# EAGLE design teensyShield1.6 (EAGLE 7.7.0)
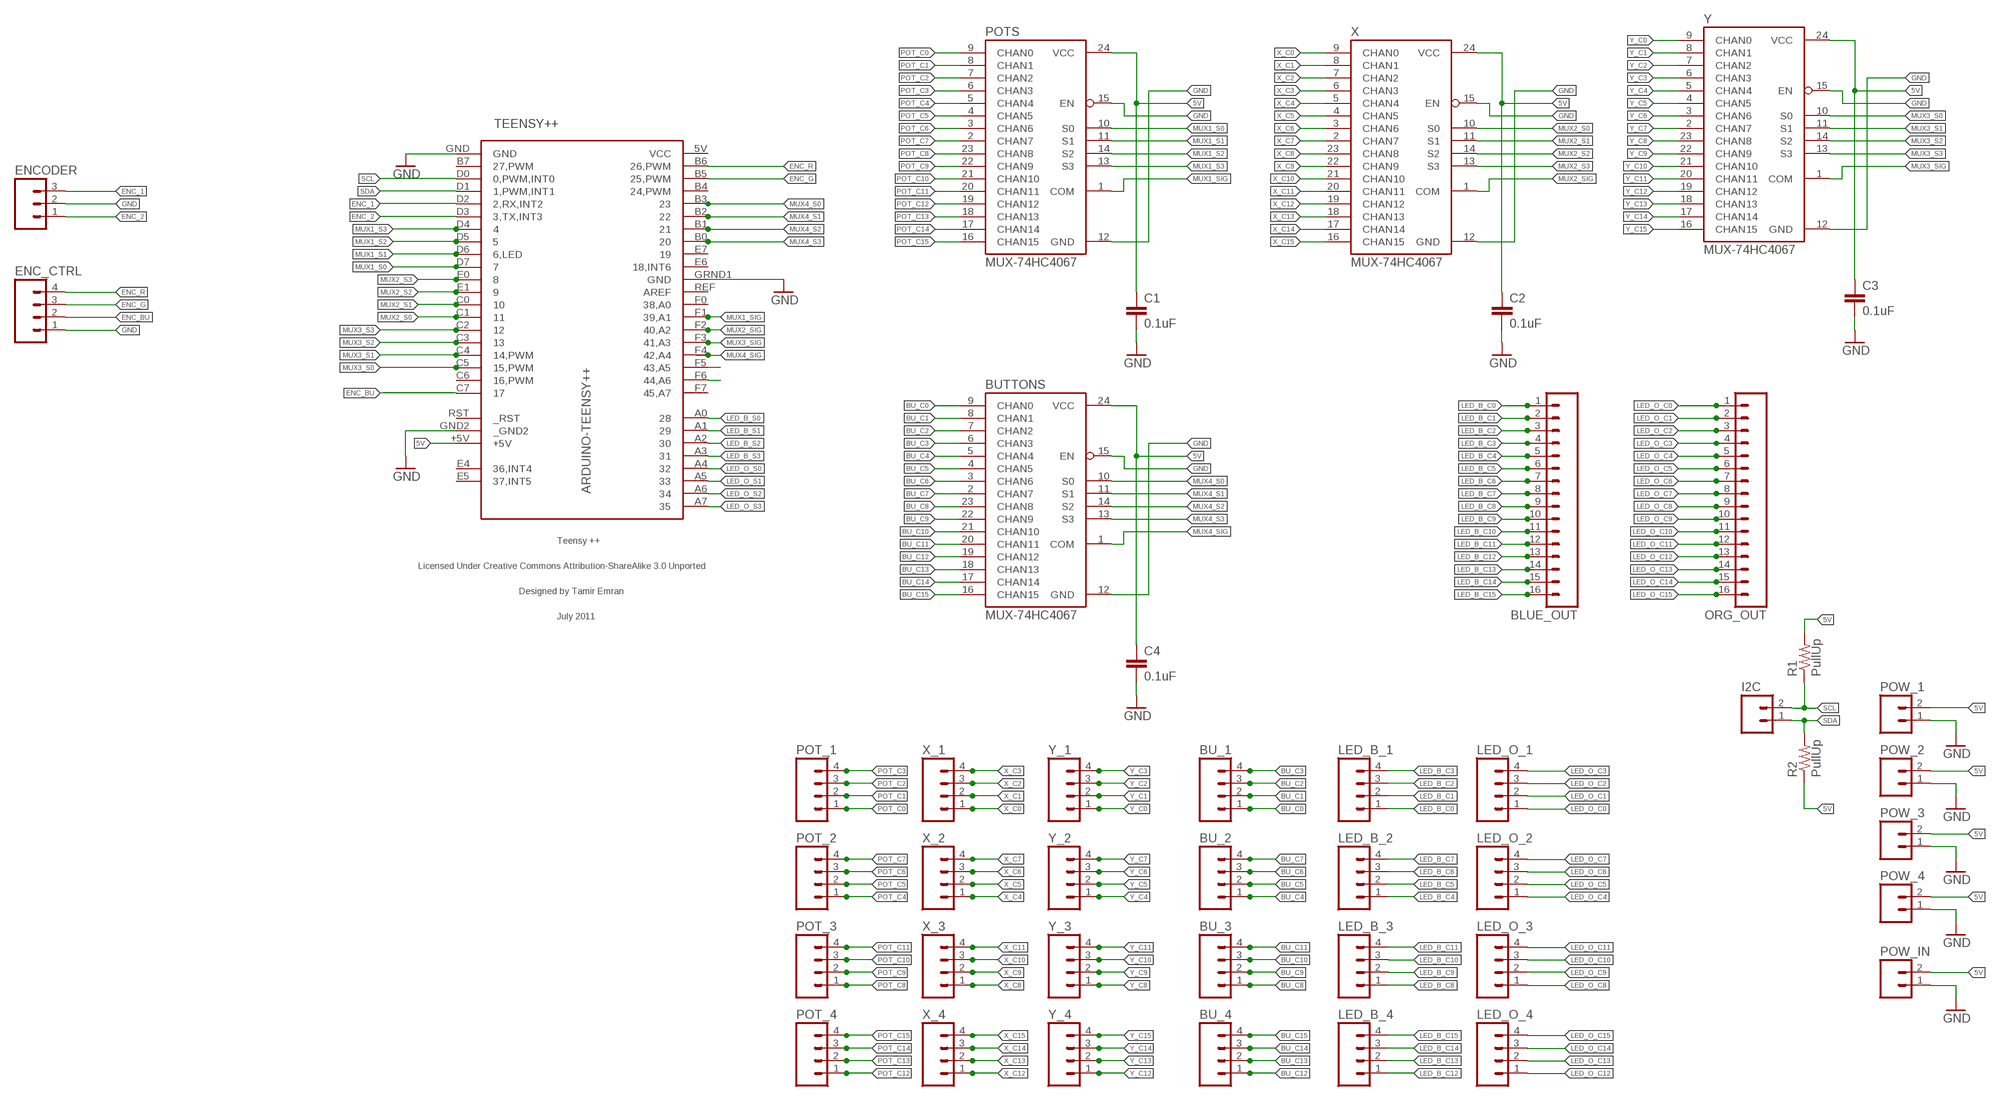
[diagram p0: schematic, sheet 1]

## Parts
BLUE_OUT  M161X16_NO_SILK  [1X16_NO_SILK]
BU_1  M04NO_SILK_ALL_ROUND  [1X04_NO_SILK_ALL_ROUND]
BU_2  M04NO_SILK_ALL_ROUND  [1X04_NO_SILK_ALL_ROUND]
BU_3  M04NO_SILK_ALL_ROUND  [1X04_NO_SILK_ALL_ROUND]
BU_4  M04NO_SILK_ALL_ROUND  [1X04_NO_SILK_ALL_ROUND]
BUTTONS  MUX-74HC4067  MUX-74HC4067SMD  [SSOP24]
C1  0.1uF  CAP0603  [0603]
C2  0.1uF  CAP0603  [0603]
C3  0.1uF  CAP0603  [0603]
C4  0.1uF  CAP0603  [0603]
ENC_CTRL  M041X04_NO_SILK  [1X04_NO_SILK]
ENCODER  M031X03_NO_SILK  [1X03_NO_SILK]
I2C  M02LOCK  [1X02_LOCK]
LED_B_1  M04NO_SILK_ALL_ROUND  [1X04_NO_SILK_ALL_ROUND]
LED_B_2  M04NO_SILK_ALL_ROUND  [1X04_NO_SILK_ALL_ROUND]
LED_B_3  M04NO_SILK_ALL_ROUND  [1X04_NO_SILK_ALL_ROUND]
LED_B_4  M04NO_SILK_ALL_ROUND  [1X04_NO_SILK_ALL_ROUND]
LED_O_1  M04NO_SILK_ALL_ROUND  [1X04_NO_SILK_ALL_ROUND]
LED_O_2  M04NO_SILK_ALL_ROUND  [1X04_NO_SILK_ALL_ROUND]
LED_O_3  M04NO_SILK_ALL_ROUND  [1X04_NO_SILK_ALL_ROUND]
LED_O_4  M04NO_SILK_ALL_ROUND  [1X04_NO_SILK_ALL_ROUND]
ORG_OUT  M161X16_NO_SILK  [1X16_NO_SILK]
POT_1  M04NO_SILK_ALL_ROUND  [1X04_NO_SILK_ALL_ROUND]
POT_2  M04NO_SILK_ALL_ROUND  [1X04_NO_SILK_ALL_ROUND]
POT_3  M04NO_SILK_ALL_ROUND  [1X04_NO_SILK_ALL_ROUND]
POT_4  M04NO_SILK_ALL_ROUND  [1X04_NO_SILK_ALL_ROUND]
POTS  MUX-74HC4067  MUX-74HC4067SMD  [SSOP24]
POW_1  M02POLAR  [MOLEX-1X2]
POW_2  M02POLAR  [MOLEX-1X2]
POW_3  M02POLAR  [MOLEX-1X2]
POW_4  M02POLAR  [MOLEX-1X2]
POW_IN  M02POLAR  [MOLEX-1X2]
R1  PullUp  10KOHM-1/4W5%(PTH)  [AXIAL-0.3]
R2  PullUp  10KOHM-1/4W5%(PTH)  [AXIAL-0.3]
TEENSY++  ARDUINO-TEENSY++  [TEENSY++]
X  MUX-74HC4067  MUX-74HC4067SMD  [SSOP24]
X_1  M04NO_SILK_ALL_ROUND  [1X04_NO_SILK_ALL_ROUND]
X_2  M04NO_SILK_ALL_ROUND  [1X04_NO_SILK_ALL_ROUND]
X_3  M04NO_SILK_ALL_ROUND  [1X04_NO_SILK_ALL_ROUND]
X_4  M04NO_SILK_ALL_ROUND  [1X04_NO_SILK_ALL_ROUND]
Y  MUX-74HC4067  MUX-74HC4067SMD  [SSOP24]
Y_1  M04NO_SILK_ALL_ROUND  [1X04_NO_SILK_ALL_ROUND]
Y_2  M04NO_SILK_ALL_ROUND  [1X04_NO_SILK_ALL_ROUND]
Y_3  M04NO_SILK_ALL_ROUND  [1X04_NO_SILK_ALL_ROUND]
Y_4  M04NO_SILK_ALL_ROUND  [1X04_NO_SILK_ALL_ROUND]

## Nets
5V: BUTTONS.24(VCC) C1.1 C2.1 C3.1 C4.1 POTS.24(VCC) POW_1.2 POW_2.2 POW_3.2 POW_4.2 POW_IN.2 R1.P$2 R2.P$1 TEENSY++.+5V X.24(VCC) Y.24(VCC)
BU_C0: BU_1.1 BUTTONS.9(CHAN0)
BU_C1: BU_1.2 BUTTONS.8(CHAN1)
BU_C2: BU_1.3 BUTTONS.7(CHAN2)
BU_C3: BU_1.4 BUTTONS.6(CHAN3)
BU_C4: BU_2.1 BUTTONS.5(CHAN4)
BU_C5: BU_2.2 BUTTONS.4(CHAN5)
BU_C6: BU_2.3 BUTTONS.3(CHAN6)
BU_C7: BU_2.4 BUTTONS.2(CHAN7)
BU_C8: BU_3.1 BUTTONS.23(CHAN8)
BU_C9: BU_3.2 BUTTONS.22(CHAN9)
BU_C10: BU_3.3 BUTTONS.21(CHAN10)
BU_C11: BU_3.4 BUTTONS.20(CHAN11)
BU_C12: BU_4.1 BUTTONS.19(CHAN12)
BU_C13: BU_4.2 BUTTONS.18(CHAN13)
BU_C14: BU_4.3 BUTTONS.17(CHAN14)
BU_C15: BU_4.4 BUTTONS.16(CHAN15)
ENC_1: ENCODER.3 TEENSY++.D2(2,RX,INT2)
ENC_2: ENCODER.1 TEENSY++.D3(3,TX,INT3)
ENC_BU: ENC_CTRL.2 TEENSY++.C7
ENC_G: ENC_CTRL.3 TEENSY++.B5(25,PWM)
ENC_R: ENC_CTRL.4 TEENSY++.B6(26,PWM)
GND: BUTTONS.12(GND) BUTTONS.15(EN) C1.2 C2.2 C3.2 C4.2 ENC_CTRL.1 ENCODER.2 POTS.12(GND) POTS.15(EN) POW_1.1 POW_2.1 POW_3.1 POW_4.1 POW_IN.1 TEENSY++.GND TEENSY++.GND2(_GND2) TEENSY++.GRND1(GND) X.12(GND) X.15(EN) Y.12(GND) Y.15(EN)
LED_B_C0: BLUE_OUT.1 LED_B_1.1
LED_B_C1: BLUE_OUT.2 LED_B_1.2
LED_B_C2: BLUE_OUT.3 LED_B_1.3
LED_B_C3: BLUE_OUT.4 LED_B_1.4
LED_B_C4: BLUE_OUT.5 LED_B_2.1
LED_B_C5: BLUE_OUT.6 LED_B_2.2
LED_B_C6: BLUE_OUT.7 LED_B_2.3
LED_B_C7: BLUE_OUT.8 LED_B_2.4
LED_B_C8: BLUE_OUT.9 LED_B_3.1
LED_B_C9: BLUE_OUT.10 LED_B_3.2
LED_B_C10: BLUE_OUT.11 LED_B_3.3
LED_B_C11: BLUE_OUT.12 LED_B_3.4
LED_B_C12: BLUE_OUT.13 LED_B_4.1
LED_B_C13: BLUE_OUT.14 LED_B_4.2
LED_B_C14: BLUE_OUT.15 LED_B_4.3
LED_B_C15: BLUE_OUT.16 LED_B_4.4
LED_B_S0: TEENSY++.A0
LED_B_S1: TEENSY++.A1
LED_B_S2: TEENSY++.A2
LED_B_S3: TEENSY++.A3
LED_O_C0: LED_O_1.1 ORG_OUT.1
LED_O_C1: LED_O_1.2 ORG_OUT.2
LED_O_C2: LED_O_1.3 ORG_OUT.3
LED_O_C3: LED_O_1.4 ORG_OUT.4
LED_O_C4: LED_O_2.1 ORG_OUT.5
LED_O_C5: LED_O_2.2 ORG_OUT.6
LED_O_C6: LED_O_2.3 ORG_OUT.7
LED_O_C7: LED_O_2.4 ORG_OUT.8
LED_O_C8: LED_O_3.1 ORG_OUT.9
LED_O_C9: LED_O_3.2 ORG_OUT.10
LED_O_C10: LED_O_3.3 ORG_OUT.11
LED_O_C11: LED_O_3.4 ORG_OUT.12
LED_O_C12: LED_O_4.1 ORG_OUT.13
LED_O_C13: LED_O_4.2 ORG_OUT.14
LED_O_C14: LED_O_4.3 ORG_OUT.15
LED_O_C15: LED_O_4.4 ORG_OUT.16
LED_O_S0: TEENSY++.A4
LED_O_S1: TEENSY++.A5
LED_O_S2: TEENSY++.A6
LED_O_S3: TEENSY++.A7
MUX1_S0: POTS.10(S0) TEENSY++.D7
MUX1_S1: POTS.11(S1) TEENSY++.D6(6,LED)
MUX1_S2: POTS.14(S2) TEENSY++.D5
MUX1_S3: POTS.13(S3) TEENSY++.D4
MUX1_SIG: POTS.1(COM)
MUX2_S0: TEENSY++.C1 X.10(S0)
MUX2_S1: TEENSY++.C0 X.11(S1)
MUX2_S2: TEENSY++.E1 X.14(S2)
MUX2_S3: TEENSY++.E0 X.13(S3)
MUX2_SIG: X.1(COM)
MUX3_S0: TEENSY++.C5(15,PWM) Y.10(S0)
MUX3_S1: TEENSY++.C4(14,PWM) Y.11(S1)
MUX3_S2: TEENSY++.C3 Y.14(S2)
MUX3_S3: TEENSY++.C2 Y.13(S3)
MUX3_SIG: TEENSY++.F3(41,A3) Y.1(COM)
MUX4_S0: BUTTONS.10(S0) TEENSY++.B3
MUX4_S1: BUTTONS.11(S1) TEENSY++.B2
MUX4_S2: BUTTONS.14(S2) TEENSY++.B1
MUX4_S3: BUTTONS.13(S3) TEENSY++.B0
MUX4_SIG: BUTTONS.1(COM) TEENSY++.F4(42,A4)
N$1: TEENSY++.F2(40,A2)
N$2: TEENSY++.F1(39,A1)
N$3: TEENSY++.F5(43,A5)
N$5: TEENSY++.F6(44,A6)
POT_C0: POT_1.1 POTS.9(CHAN0)
POT_C1: POT_1.2 POTS.8(CHAN1)
POT_C2: POT_1.3 POTS.7(CHAN2)
POT_C3: POT_1.4 POTS.6(CHAN3)
POT_C4: POT_2.1 POTS.5(CHAN4)
POT_C5: POT_2.2 POTS.4(CHAN5)
POT_C6: POT_2.3 POTS.3(CHAN6)
POT_C7: POT_2.4 POTS.2(CHAN7)
POT_C8: POT_3.1 POTS.23(CHAN8)
POT_C9: POT_3.2 POTS.22(CHAN9)
POT_C10: POT_3.3 POTS.21(CHAN10)
POT_C11: POT_3.4 POTS.20(CHAN11)
POT_C12: POT_4.1 POTS.19(CHAN12)
POT_C13: POT_4.2 POTS.18(CHAN13)
POT_C14: POT_4.3 POTS.17(CHAN14)
POT_C15: POT_4.4 POTS.16(CHAN15)
SCL: I2C.2 R1.P$1 TEENSY++.D0(0,PWM,INT0)
SDA: I2C.1 R2.P$2 TEENSY++.D1(1,PWM,INT1)
X_C0: X.9(CHAN0) X_1.1
X_C1: X.8(CHAN1) X_1.2
X_C2: X.7(CHAN2) X_1.3
X_C3: X.6(CHAN3) X_1.4
X_C4: X.5(CHAN4) X_2.1
X_C5: X.4(CHAN5) X_2.2
X_C6: X.3(CHAN6) X_2.3
X_C7: X.2(CHAN7) X_2.4
X_C8: X.23(CHAN8) X_3.1
X_C9: X.22(CHAN9) X_3.2
X_C10: X.21(CHAN10) X_3.3
X_C11: X.20(CHAN11) X_3.4
X_C12: X.19(CHAN12) X_4.1
X_C13: X.18(CHAN13) X_4.2
X_C14: X.17(CHAN14) X_4.3
X_C15: X.16(CHAN15) X_4.4
Y_C0: Y.9(CHAN0) Y_1.1
Y_C1: Y.8(CHAN1) Y_1.2
Y_C2: Y.7(CHAN2) Y_1.3
Y_C3: Y.6(CHAN3) Y_1.4
Y_C4: Y.5(CHAN4) Y_2.1
Y_C5: Y.4(CHAN5) Y_2.2
Y_C6: Y.3(CHAN6) Y_2.3
Y_C7: Y.2(CHAN7) Y_2.4
Y_C8: Y.23(CHAN8) Y_3.1
Y_C9: Y.22(CHAN9) Y_3.2
Y_C10: Y.21(CHAN10) Y_3.3
Y_C11: Y.20(CHAN11) Y_3.4
Y_C12: Y.19(CHAN12) Y_4.1
Y_C13: Y.18(CHAN13) Y_4.2
Y_C14: Y.17(CHAN14) Y_4.3
Y_C15: Y.16(CHAN15) Y_4.4
Unconnected: TEENSY++.B4(24,PWM) TEENSY++.B7(27,PWM) TEENSY++.C6(16,PWM) TEENSY++.E4(36,INT4) TEENSY++.E5(37,INT5) TEENSY++.E6(18,INT6) TEENSY++.E7 TEENSY++.F0(38,A0) TEENSY++.F7(45,A7) TEENSY++.REF(AREF) TEENSY++.RST(_RST)

## Power pins joined to a net without a drawn wire
VCC: TEENSY++.5V(VCC)

## Library data of the parts
BLUE_OUT ORG_OUT = SparkFun-Connectors:M16: 1x16 .1" header
BU_1-BU_4 ENC_CTRL LED_B_1-LED_B_4 LED_O_1-LED_O_4 POT_1-POT_4 X_1-X_4 Y_1-Y_4 = SparkFun-Connectors:M04: Header 4 Standard 4-pin 0.1" header. Use with straight break away headers (SKU : PRT-00116), right angle break away headers (PRT-00553), swiss pins (PRT-00743), machine pins (PRT-00117), and female headers (PRT-00115). Molex polarized connector foot print use with SKU : PRT-08231 with associated crimp pins and housings. 1MM SMD Version SKU: PRT-10208; PROD_ID: CONN-09696
BUTTONS POTS X Y = SparkFun:MUX-74HC4067
C1-C4 = SparkFun:CAP: Capacitor Standard 0603 ceramic capacitor, and 0.1" leaded capacitor.
ENCODER = SparkFun-Connectors:M03: Header 3 Standard 3-pin 0.1" header. Use with straight break away headers (SKU : PRT-00116), right angle break away headers (PRT-00553), swiss pins (PRT-00743), machine pins (PRT-00117), and female headers (PRT-00115). Molex polarized connector foot print use with SKU : PRT-08232 with associated crimp pins and housings.
I2C POW_1-POW_4 POW_IN = SparkFun-Connectors:M02: Standard 2-pin 0.1" header. Use with - straight break away headers ( PRT-00116) - right angle break away headers (PRT-00553) - swiss pins (PRT-00743) - machine pins (PRT-00117) - female headers (PRT-00115) Molex polarized connector foot print use with: PRT-08233 with associated crimp pins and housings. 2.54_SCREWTERM for use with PRT-10571. 3.5mm Screw Terminal footprints for PRT-08084 5mm Screw Terminal footprints for use with PRT-08432
R1 R2 = SparkFun-Resistors:10KOHM-1/4W5%(PTH): RES-09435; PROD_ID: RES-9435; VALUE: 10k
TEENSY++ = teensypp:ARDUINO-TEENSY++: Teensy ++ Original Design by Mark Gross Modified Design by Tamir Emran Licensed Under Creative Commons Attribution-ShareAlike 3.0 Unported (CC BY-SA 3.0)

## Board
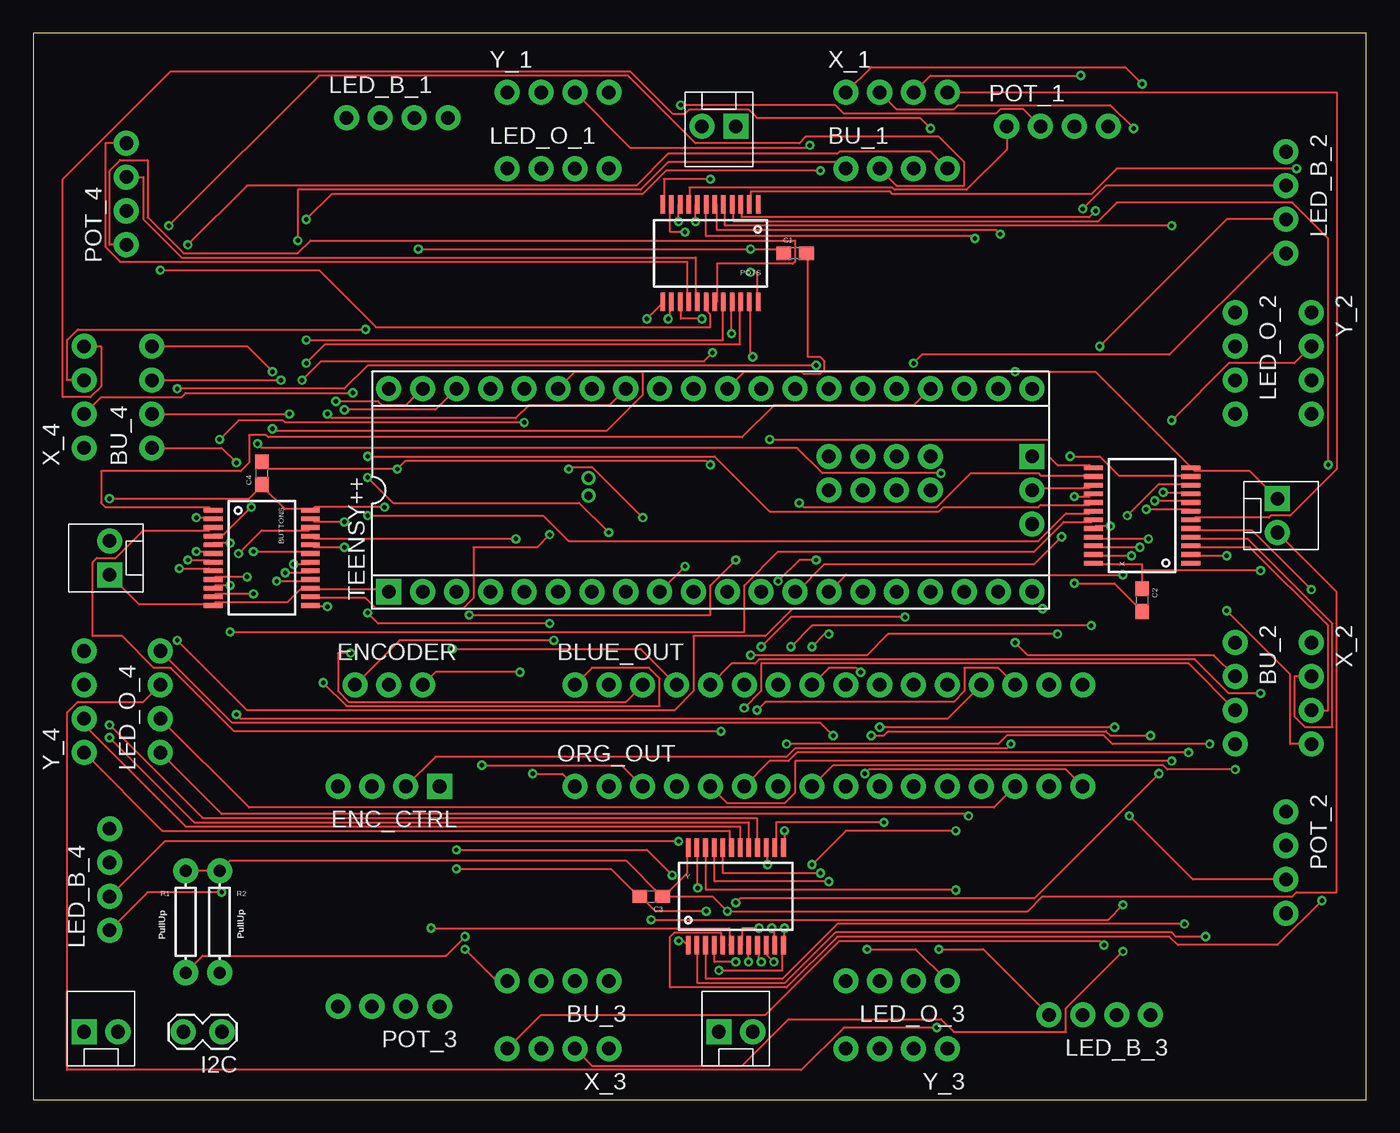
[diagram p1: board, top side]
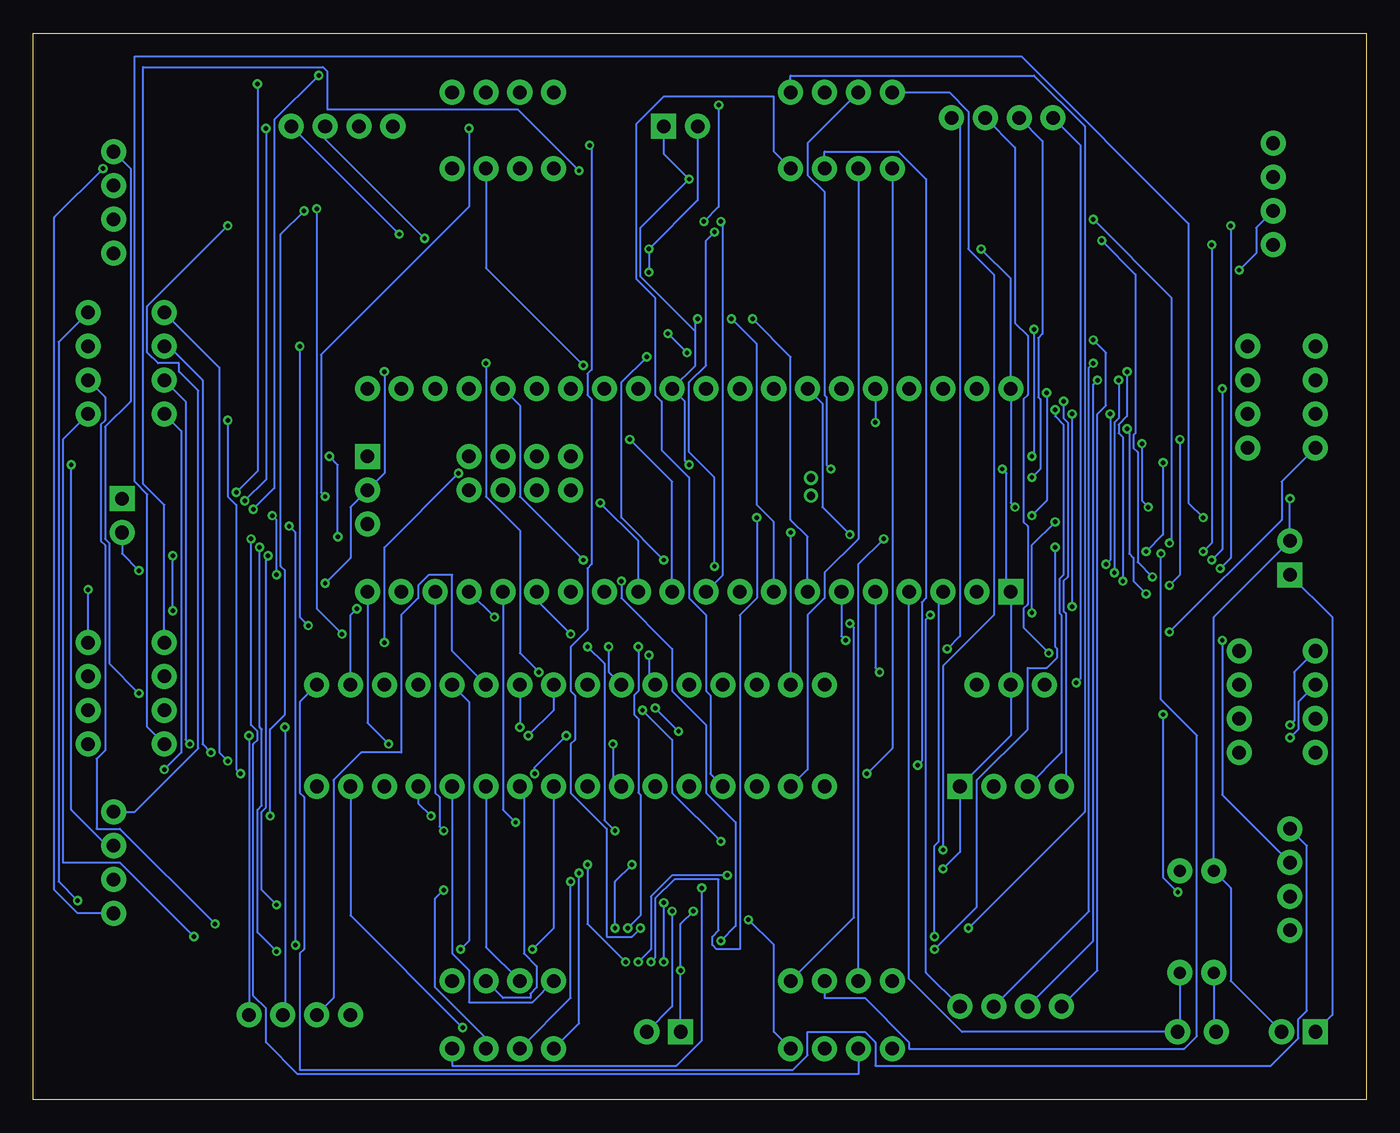
[diagram p2: board, bottom side, seen from below]

Size 100 x 80 mm. Coordinates in mm from the lower left corner, seen from the top.
Outline: 0,0 100,0 100,80 0,80 0,0
Copper layers (1*16): Top 0.0356mm / dielectric 1.5011mm / Bottom 0.0356mm
Design rules "oshpark-2layer *": minimum track width 6mil, minimum drill 13mil, track to track 6mil, track to pad 6mil, pad to pad 6mil, via to via 6mil, smd to smd 6mil, copper to edge 15mil, drill to drill 6mil, minimum pad ring 8mil, minimum via ring 7mil, stop-mask expansion 2.5mil, vias tented up to drill 0mil, thermal gap 10mil

### Footprints (pad centres in the part's own frame; a part is rotated, then mirrored left to right if it is on the bottom)
1X16_NO_SILK = drill 1.016 pad 1.88: 1 0,0; 2 2.54,0; 3 5.08,0; 4 7.62,0; 5 10.16,0; 6 12.7,0; 7 15.24,0; 8 17.78,0; 9 20.32,0; 10 22.86,0; 11 25.4,0; 12 27.94,0; 13 30.48,0; 14 33.02,0; 15 35.56,0; 16 38.1,0
1X04_NO_SILK_ALL_ROUND = drill 1.016 pad 1.88: 1 0,0; 2 2.54,0; 3 5.08,0; 4 7.62,0
SSOP24 = smd 0.348 x 1.397: 1 -3.575,-3.656; 2 -2.925,-3.656; 3 -2.275,-3.656; 4 -1.625,-3.656; 5 -0.975,-3.656; 6 -0.325,-3.656; 7 0.325,-3.656; 8 0.975,-3.656; 9 1.625,-3.656; 10 2.275,-3.656; 11 2.925,-3.656; 12 3.575,-3.656; 13 3.575,3.656; 14 2.925,3.656; 15 2.275,3.656; 16 1.625,3.656; 17 0.975,3.656; 18 0.325,3.656; 19 -0.325,3.656; 20 -0.975,3.656; 21 -1.625,3.656; 22 -2.275,3.656; 23 -2.925,3.656; 24 -3.575,3.656
0603 = smd 1.1 x 1: 1 -0.85,0; 2 0.85,0
1X04_NO_SILK = drill 1.016 pad 1.88 square: 1 0,0 | drill 1.016 pad 1.88: 2 2.54,0; 3 5.08,0; 4 7.62,0
1X03_NO_SILK = drill 1.016 pad 1.88: 1 0,0; 2 2.54,0; 3 5.08,0
1X02_LOCK = drill 1.016 pad 1.88: 1 -0.178,0; 2 2.718,0
MOLEX-1X2 = drill 1.016 pad 1.88 square: 1 0,0 | drill 1.016 pad 1.88: 2 2.54,0
AXIAL-0.3 = drill 0.9 pad 1.88: P$1 -3.81,0; P$2 3.81,0
TEENSY++ = drill 1.016 pad 1.88: 5V 24.13,-2.54; +5V -24.13,7.62; A0 8.89,0; A1 11.43,0; A2 13.97,0; A3 16.51,0; A4 8.89,2.54; A5 11.43,2.54; A6 13.97,2.54; A7 16.51,2.54; B0 -6.35,7.62; B1 -8.89,7.62; B2 -11.43,7.62; B3 -13.97,7.62; B4 -16.51,7.62; B5 -19.05,7.62; B6 -21.59,7.62; B7 -21.59,-7.62; C0 6.35,-7.62; C1 8.89,-7.62; C2 11.43,-7.62; C3 13.97,-7.62; C4 16.51,-7.62; C5 19.05,-7.62; C6 21.59,-7.62; C7 24.13,-7.62; D0 -19.05,-7.62; D1 -16.51,-7.62; D2 -13.97,-7.62; D3 -11.43,-7.62; D4 -8.89,-7.62; D5 -6.35,-7.62; D6 -3.81,-7.62; D7 -1.27,-7.62; E0 1.27,-7.62; E1 3.81,-7.62; E6 -1.27,7.62; E7 -3.81,7.62; F0 6.35,7.62; F1 8.89,7.62; F2 11.43,7.62; F3 13.97,7.62; F4 16.51,7.62; F5 19.05,7.62; F6 21.59,7.62; F7 24.13,7.62; GND2 24.13,0; GRND1 1.27,7.62; REF 3.81,7.62 | drill 0.635 pad 1.067: E4 -9.144,0.914; E5 -9.144,-0.406 | drill 1.016 pad 1.88 square: GND -24.13,-7.62; RST 24.13,2.54

### Placement (x,y rotation side)
BLUE_OUT  40.64,31.11 0 top
BU_1  60.96,69.85 0 top
BU_2  90.17,34.29 270 top
BU_3  43.18,8.89 180 top
BU_4  8.89,48.9 90 top
BUTTONS  17.14,40.64 270 top
C1  57.15,63.5 0 top
C2  83.19,37.47 270 top
C3  46.35,15.24 180 top
C4  17.14,46.99 90 top
ENC_CTRL  30.48,23.5 180 top
ENCODER  24.13,31.11 0 top
I2C  13.97,5.08 180 top
LED_B_1  23.5,73.66 0 top
LED_B_2  93.98,71.12 270 top
LED_B_3  83.82,6.35 180 top
LED_B_4  5.71,12.7 90 top
LED_O_1  35.56,69.85 0 top
LED_O_2  90.17,59.05 270 top
LED_O_3  68.58,8.89 180 top
LED_O_4  9.53,26.04 90 top
ORG_OUT  40.64,23.5 0 top
POT_1  73.03,73.03 0 top
POT_2  93.98,21.59 270 top
POT_3  30.48,6.99 180 top
POT_4  6.99,64.14 90 top
POTS  50.8,63.5 180 top
POW_1  5.71,39.37 90 top
POW_2  52.7,73.03 180 top
POW_3  93.34,45.09 270 top
POW_4  51.44,5.08 0 top
POW_IN  3.81,5.08 0 top
R1  11.43,13.34 90 top
R2  13.97,13.34 270 top
TEENSY++  50.8,45.72 0 top
X  83.19,43.81 90 top
X_1  60.96,75.56 0 top
X_2  95.89,34.29 270 top
X_3  43.18,3.81 180 top
X_4  3.81,48.9 90 top
Y  52.7,15.24 0 top
Y_1  35.56,75.56 0 top
Y_2  95.89,59.05 270 top
Y_3  68.58,3.81 180 top
Y_4  3.81,26.04 90 top

### Tracks (layer width: path | path; a pad name or v marks a point on that pad's centre or on a via)
5V  (via drill 0.33)
  Top 0.152: C1.1 56.2,63.5 55.88,63.82 v53.82,63.82 v28.89,63.82 | v53.82,62.07 54.29,62.07 54.29,59.85 POTS.24 | 17.14,46.04 18.89,44.29 20.8,44.29 BUTTONS.24 20.95,44.29 21.11,44.45 v26.35,44.45 | 17.14,46.04 16.19,45.09 v5.71,45.09 | 17.14,46.04 C4.1 | 83.19,39.69 83.19,40.16 79.53,40.16 X.24 | 83.19,39.69 C2.1 | v92.08,39.69 83.19,39.69 | 47.31,15.24 49.05,16.99 49.05,18.89 Y.24 | 47.31,15.24 50.96,15.24 v52.07,14.13 74.61,14.13 75.72,15.24 94.46,15.24 94.77,15.56 97.79,15.56 97.79,38.1 POW_3.2 | 47.31,15.24 C3.1 47.15,15.24 44.45,17.94 14.76,17.94 R2.P$1 R1.P$2
  Bottom 0.152: POW_2.2 50.16,67.47 v53.82,63.82 v53.82,62.07 | v26.35,44.45 26.67,44.77 TEENSY++.+5V 26.67,61.59 v28.89,63.82 | POW_IN.2 10.16,8.89 10.16,15.88 R1.P$2 11.43,36.2 POW_1.2 v5.71,45.09 | v92.08,39.69 93.34,40.96 POW_3.2 | POW_4.2 52.07,6.99 v52.07,14.13
BU_C0  (via drill 0.33)
  Top 0.152: v16.03,39.21 13.65,39.21 13.49,39.05 BUTTONS.9 | v19.84,64.45 19.84,68.26 45.56,68.26 47.62,70.33 60.48,70.33 BU_1.1
  Bottom 0.152: v16.03,39.21 17.14,40.32 17.14,48.58 17.46,48.9 17.46,49.85 17.3,50.01 17.3,61.91 v19.84,64.45
BU_C1  (via drill 0.33)
  Top 0.152: v10.95,39.85 13.18,39.85 13.34,39.69 BUTTONS.8 | v10.16,65.56 21.43,76.83 44.61,76.83 49.69,71.75 57.47,71.75 57.94,72.23 67.94,72.23 69.85,70.33 69.85,68.58 64.77,68.58 BU_1.2
  Bottom 0.152: v10.95,39.85 10.16,40.64 v10.16,65.56
BU_C2  (via drill 0.33)
  Top 0.152: v11.59,40.48 13.18,40.48 13.34,40.32 BUTTONS.7 | v10.79,53.34 23.34,53.34 25.08,55.09 v58.74,55.09
  Bottom 0.152: v11.59,40.48 10.79,41.27 v10.79,53.34 | v58.74,55.09 66.04,62.39 BU_1.3
BU_C3  (via drill 0.33)
  Top 0.152: v12.22,41.12 13.34,41.12 BUTTONS.6 | v11.59,64.14 16.03,68.58 45.24,68.58 47.62,70.96 60.33,70.96 60.48,71.12 67.31,71.12 BU_1.4
  Bottom 0.152: v12.22,41.12 11.59,41.75 v11.59,64.14
BU_C4  (via drill 0.33)
  Top 0.152: v14.76,41.75 13.49,41.75 BUTTONS.5 | v20.48,66.04 22.38,67.94 45.72,67.94 47.47,69.69 v59.05,69.69
  Bottom 0.152: v14.76,41.75 14.61,41.91 14.61,60.17 v20.48,66.04 | v59.05,69.69 63.66,74.3 77.95,74.3 77.95,77.15 78.26,77.47 91.76,77.47 91.76,46.2 90.17,44.61 BU_2.1
BU_C5  (via drill 0.33)
  Top 0.152: v16.35,44.45 14.29,42.39 13.49,42.39 BUTTONS.4 | v16.83,49.21 17.14,48.9 57.31,48.9 59.21,46.99 v68.1,46.99 | v73.66,34.29 74.61,33.34 88.58,33.34 BU_2.2
  Bottom 0.152: v16.35,44.45 16.83,44.93 v16.83,49.21 | v68.1,46.99 73.66,41.43 v73.66,34.29
BU_C6  (via drill 0.33)
  Top 0.152: v51.59,27.62 15.08,27.62 10.32,32.38 9.05,32.38 6.67,34.77 4.45,34.77 4.45,40.32 4.76,40.64 6.19,40.64 8.26,42.7 13.18,42.7 13.34,42.86 BUTTONS.3 | v53.34,29.37 54.61,30.64 54.61,32.7 86.68,32.7 BU_2.3
  Bottom 0.152: v53.34,29.37 v51.59,27.62
BU_C7  (via drill 0.33)
  Top 0.152: v12.22,43.66 13.34,43.66 BUTTONS.2
  Bottom 0.152: v12.22,43.66 13.34,44.77 13.34,65.72 25.88,78.26 92.39,78.26 92.39,46.35 91.44,45.4 91.44,27.94 BU_2.4
BU_C8  (via drill 0.33)
  Top 0.152: v23.34,43.34 21.11,43.34 20.95,43.5 BUTTONS.23 | v25.08,36.51 25.88,35.72 v38.73,35.72
  Bottom 0.152: v23.34,43.34 25.08,41.59 v25.08,36.51 | v38.73,35.72 38.42,35.4 38.42,13.65 BU_3.1
BU_C9  (via drill 0.33)
  Top 0.152: v15.4,40.96 17.14,42.7 20.64,42.7 20.8,42.86 BUTTONS.22
  Bottom 0.152: v15.4,40.96 15.4,30 12.7,27.3 12.7,4.76 13.65,3.81 34.29,3.81 34.29,4.29 37.62,7.62 40.64,7.62 BU_3.2
BU_C10  (via drill 0.33)
  Top 0.152: v36.2,42.07 21.11,42.07 20.95,42.23 BUTTONS.21
  Bottom 0.152: v36.2,42.07 38.1,40.16 BU_3.3
BU_C11  (via drill 0.33)
  Top 0.152: v23.34,41.43 21.11,41.43 20.95,41.59 BUTTONS.20 | v32.38,11.27 34.77,8.89 BU_3.4
  Bottom 0.152: v23.34,41.43 23.34,33.97 23.18,33.81 23.18,33.18 23.97,32.38 25.4,32.38 25.4,27.78 29.21,23.97 29.21,14.45 v32.38,11.27
BU_C12  (via drill 0.33)
  Top 0.152: v16.51,41.12 20.8,41.12 BUTTONS.19 | v15.24,47.78 14.13,48.9 BU_4.1
  Bottom 0.152: v16.51,41.12 15.24,42.39 v15.24,47.78
BU_C13  (via drill 0.33)
  Top 0.152: v19.53,40.16 20.8,40.16 BUTTONS.18 | BU_4.2 v19.21,51.44
  Bottom 0.152: v19.53,40.16 19.21,40.48 v19.21,51.44
BU_C14  (via drill 0.33)
  Top 0.152: v18.89,39.53 20.8,39.53 BUTTONS.17 | BU_4.3 v18.57,53.98
  Bottom 0.152: v18.89,39.53 18.89,50.8 18.57,51.12 v18.57,53.98
BU_C15  (via drill 0.33)
  Top 0.152: v18.26,38.89 20.8,38.89 BUTTONS.16 | v17.94,54.61 16.03,56.52 BU_4.4
  Bottom 0.152: v18.26,38.89 18.26,49.69 18.57,50.01 18.57,50.64 17.94,51.28 v17.94,54.61
ENC_1  (via drill 0.33)
  Top 0.152: ENCODER.3 30.16,32.07 v36.51,32.07
  Bottom 0.152: v36.51,32.07 36.83,32.38 TEENSY++.D2
ENC_2  (via drill 0.33)
  Top 0.152: ENCODER.1 27.46,34.45 v39.05,34.45
  Bottom 0.152: v39.05,34.45 39.37,34.77 TEENSY++.D3
ENC_BU  (via drill 0.33)
  Top 0.152: ENC_CTRL.2 30.16,25.72 56.52,25.72 57.15,26.35 73.03,26.35 v73.34,26.67
  Bottom 0.152: v73.34,26.67 74.93,28.26 TEENSY++.C7
ENC_G  (via drill 0.33)
  Top 0.152: v23.34,51.75 30.16,51.75 TEENSY++.B5
  Bottom 0.152: ENC_CTRL.3 22.86,26.04 22.86,36.35 23.02,36.51 23.02,39.05 22.7,39.37 22.7,50.64 23.34,51.28 v23.34,51.75
ENC_R  (via drill 0.33)
  Top 0.152: v22.7,52.39 25.88,52.39 26.19,52.07 27.94,52.07 TEENSY++.B6
  Bottom 0.152: ENC_CTRL.4 22.54,23.81 22.54,36.51 22.7,36.67 22.7,38.89 22.38,39.21 22.38,50.8 22.7,51.12 v22.7,52.39
GND  (via drill 0.33)
  Top 0.152: v78.11,38.73 81.12,38.73 83.19,36.67 C2.2 | TEENSY++.GND2 75.09,45.88 79.22,45.88 79.38,46.04 X.15 | v50.8,69.06 47.31,69.06 47.31,67.31 POTS.12 | POW_3.1 91.28,47.15 87.15,47.15 87,47.31 X.12 86.84,47.47 79.69,54.61 v73.66,54.61 59.37,54.61 | 59.37,54.61 59.37,55.4 59.05,55.72 58.1,55.72 58.1,63.5 C1.2 | 59.37,54.61 59.21,54.61 59.05,54.45 57.78,54.45 57.63,54.61 53.34,54.61 TEENSY++.GRND1 | v50.16,58.58 48.58,58.58 48.58,59.69 POTS.15 | v50.48,14.13 46.67,14.13 45.56,15.24 C3.2 45.4,15.24 43.34,17.3 v31.75,17.3 | v51.44,9.68 56.2,9.68 56.2,11.43 Y.12 56.36,11.59 v56.36,12.86 | v55.09,17.62 55.09,18.89 Y.15 | C4.2 17.14,47.78 17.62,47.31 v27.3,47.31 27.94,47.94 50.48,47.94 v50.8,47.62 | TEENSY++.GND 26.51,38.26 20.95,38.26 BUTTONS.15 20.8,38.26 20,38.26 19.05,37.31 13.65,37.31 13.49,37.15 BUTTONS.12 13.34,37.15 7.94,37.15 POW_1.1
  Bottom 0.152: v78.11,38.73 76.2,40.64 76.2,44.45 TEENSY++.GND2 73.66,46.99 v73.66,54.61 | POW_2.1 52.7,70.96 v50.8,69.06 54.45,65.41 54.45,61.75 50.32,57.63 | v50.16,58.58 50.32,58.42 50.32,57.63 | 50.32,57.63 50.32,55.09 TEENSY++.GRND1 51.12,52.39 51.12,47.94 v50.8,47.62 | POW_IN.1 2.54,6.35 2.54,36.2 POW_1.1 | v50.48,14.13 51.44,13.18 v51.44,9.68 POW_4.1 | v55.09,17.62 56.36,16.35 v56.36,12.86 | v27.3,47.31 26.99,46.99 26.99,38.42 TEENSY++.GND ENCODER.2 26.67,27.3 ENC_CTRL.1 30.48,18.57 v31.75,17.3
LED_B_C0  (via drill 0.33)
  Top 0.152: BLUE_OUT.1 41.91,32.38 46.2,32.38 46.99,31.59 46.99,29.53 23.5,29.53 v21.75,31.27
  Bottom 0.152: v21.75,31.27 21.43,31.59 21.43,71.6 LED_B_1.1
LED_B_C1  (via drill 0.33)
  Top 0.152: v43.18,42.55 40.96,44.77 26.99,44.77 v25.08,46.67
  Bottom 0.152: v43.18,42.55 BLUE_OUT.2 | v25.08,46.67 24.45,47.31 24.45,52.55 24.61,52.7 24.61,57.15 24.29,57.47 24.29,71.91 LED_B_1.2
LED_B_C2  (via drill 0.33)
  Top 0.152: BLUE_OUT.3 44.45,29.84 23.65,29.84 22.86,30.64 22.86,33.5 v23.81,33.5
  Bottom 0.152: v23.81,33.5 25.72,35.4 25.72,36.83 25.4,37.15 25.4,43.02 25.72,43.34 25.72,52.55 25.4,52.86 25.4,57.31 26.35,58.26 26.35,71.44 LED_B_1.3
LED_B_C3  (via drill 0.33)
  Top 0.152: BLUE_OUT.4 45.56,33.81 v31.43,33.81
  Bottom 0.152: v31.43,33.81 30.48,34.77 30.48,73.03 LED_B_1.4
LED_B_C4  (via drill 0.33)
  Top 0.152: BLUE_OUT.5 52.39,32.7 54.13,32.7 54.45,33.02 87.15,33.02 89.69,30.48 v92.08,30.48
  Bottom 0.152: v92.08,30.48 94.3,32.7 94.3,41.75 94.61,42.07 94.61,50.48 92.71,52.39 92.71,69.85 LED_B_2.1
LED_B_C5  (via drill 0.33)
  Top 0.152: v53.82,33.34 62.55,33.34 64.14,34.92 v76.83,34.92 | v78.74,66.83 80.49,68.58 LED_B_2.2
  Bottom 0.152: BLUE_OUT.6 53.82,31.59 v53.82,33.34 | v76.83,34.92 78.74,36.83 v78.74,66.83
LED_B_C6  (via drill 0.33)
  Top 0.152: v56.83,33.97 58.42,35.56 v79.38,35.56 | v80.01,56.52 89.53,66.04 LED_B_2.3
  Bottom 0.152: BLUE_OUT.7 56.83,32.07 v56.83,33.97 | v79.38,35.56 80.01,36.2 v80.01,56.52
LED_B_C7  (via drill 0.33)
  Top 0.152: BLUE_OUT.8 59.69,32.38 61.75,32.38 v62.07,32.07 | v66.04,55.24 66.67,55.88 85.25,55.88 92.87,63.5 LED_B_2.4
  Bottom 0.152: v62.07,32.07 63.5,33.5 63.5,42.7 66.04,45.24 v66.04,55.24
LED_B_C8  (via drill 0.33)
  Top 0.152: v83.82,27.3 80.8,27.3 80.49,27.62 64.14,27.62 63.82,27.3 v62.87,27.3
  Bottom 0.152: v83.82,27.3 LED_B_3.1 | v62.87,27.3 60.96,29.21 BLUE_OUT.9
LED_B_C9  (via drill 0.33)
  Top 0.152: v63.5,27.94 v81.12,27.94
  Bottom 0.152: LED_B_3.2 81.12,6.51 v81.12,27.94 | BLUE_OUT.10 v63.5,27.94
LED_B_C10
  Bottom 0.152: LED_B_3.3 77.47,7.62 77.47,23.97 75.41,26.04 72.39,26.04 72.39,36.35 71.12,37.62 71.12,38.58 70.33,39.37 68.58,39.37 68.58,33.66 BLUE_OUT.11
LED_B_C11  (via drill 0.33)
  Top 0.152: LED_B_3.4 71.28,11.27 v67.94,11.27
  Bottom 0.152: v67.94,11.27 67.31,11.91 67.31,29.84 BLUE_OUT.12
LED_B_C12  (via drill 0.33)
  Top 0.152: LED_B_4.1 8.57,15.56 v14.13,15.56 | v15.24,28.89 15.56,28.57 68.58,28.57 BLUE_OUT.13
  Bottom 0.152: v14.13,15.56 15.24,16.67 v15.24,28.89
LED_B_C13  (via drill 0.33)
  Top 0.152: LED_B_4.2 9.84,19.37 v48.42,19.37 | v54.29,29.21 54.93,29.84 69.06,29.84 69.85,30.64 69.85,32.38 72.39,32.38 BLUE_OUT.14
  Bottom 0.152: v48.42,19.37 52.07,23.02 52.07,26.99 v54.29,29.21
LED_B_C14  (via drill 0.33)
  Top 0.152: v10.79,34.45 16.03,29.21 48.1,29.21 49.53,30.64 49.53,34.77 54.93,34.77 56.99,36.83 v75.72,36.83
  Bottom 0.152: LED_B_4.3 10.79,22.86 v10.79,34.45 | v75.72,36.83 76.2,36.35 BLUE_OUT.15
LED_B_C15
  Bottom 0.152: LED_B_4.4 4.45,19.05 4.45,6.67 5.08,6.03 5.08,4.6 7.14,2.54 36.83,2.54 36.83,4.29 37.62,5.08 41.91,5.08 41.91,3.33 43.02,2.22 80.01,2.22 80.01,10.95 79.69,11.27 79.69,22.7 80.01,23.02 80.01,29.84 BLUE_OUT.16
LED_O_C0  (via drill 0.33)
  Top 0.152: ORG_OUT.1 39.69,24.45 v37.47,24.45
  Bottom 0.152: v37.47,24.45 35.56,26.35 LED_O_1.1
LED_O_C1
  Bottom 0.152: ORG_OUT.2 41.91,24.77 41.91,36.35 40.64,37.62 40.64,39.53 38.1,42.07 LED_O_1.2
LED_O_C2  (via drill 0.33)
  Top 0.152: ORG_OUT.3 44.13,25.08 v33.66,25.08
  Bottom 0.152: v33.66,25.08 33.34,25.4 33.34,37.31 33.02,37.62 33.02,69.06 35.08,71.12 40.64,71.12 LED_O_1.3
LED_O_C3
  Bottom 0.152: ORG_OUT.4 49.21,24.45 49.21,30.32 49.53,30.64 49.53,36.35 50.8,37.62 50.8,46.67 52.86,48.74 52.86,52.39 53.34,52.86 53.34,60.17 54.77,61.59 54.77,73.18 52.7,75.25 44.45,75.25 44.45,71.12 LED_O_1.4
LED_O_C4  (via drill 0.33)
  Top 0.152: ORG_OUT.5 52.07,22.23 56.36,22.23 57.15,23.02 57.15,25.4 v85.41,25.4
  Bottom 0.152: v85.41,25.4 86.04,26.04 86.04,54.93 LED_O_2.1
LED_O_C5  (via drill 0.33)
  Top 0.152: ORG_OUT.6 55.24,25.4 56.67,25.4 57.31,26.04 v86.68,26.04
  Bottom 0.152: v86.68,26.04 87.31,26.67 87.31,53.98 89.85,56.52 LED_O_2.2
LED_O_C6  (via drill 0.33)
  Top 0.152: v56.52,26.67 72.39,26.67 73.03,27.3 80.33,27.3 80.96,26.67 v88.27,26.67
  Bottom 0.152: ORG_OUT.7 56.52,24.13 v56.52,26.67 | v88.27,26.67 88.58,26.99 88.58,52.39 LED_O_2.3
LED_O_C7  (via drill 0.33)
  Top 0.152: ORG_OUT.8 60.01,25.08 84.77,25.08 85.09,24.77 v90.17,24.77
  Bottom 0.152: v90.17,24.77 88.9,26.04 88.9,50.16 LED_O_2.4
LED_O_C8  (via drill 0.33)
  Top 0.152: LED_O_3.1 66.2,11.27 v62.55,11.27
  Bottom 0.152: v62.55,11.27 60.96,12.86 ORG_OUT.9
LED_O_C9
  Bottom 0.152: LED_O_3.2 64.77,7.62 62.71,7.62 62.71,7.94 62.23,8.41 62.23,10 63.18,10.95 63.18,23.18 ORG_OUT.10
LED_O_C10
  Bottom 0.152: LED_O_3.3 66.04,11.43 ORG_OUT.11
LED_O_C11
  Bottom 0.152: LED_O_3.4 62.55,7.3 67.31,7.3 67.31,9.68 68.58,10.95 ORG_OUT.12
LED_O_C12  (via drill 0.33)
  Top 0.152: LED_O_4.1 14.13,21.43 70.01,21.43 v70.17,21.27
  Bottom 0.152: v70.17,21.27 71.12,22.23 ORG_OUT.13
LED_O_C13
  Top 0.152: LED_O_4.2 16.19,21.91 72.07,21.91 ORG_OUT.14
LED_O_C14  (via drill 0.33)
  Top 0.152: LED_O_4.3 8.26,29.84 3.33,29.84 2.54,29.05 2.54,2.22 57.63,2.22 60.8,5.4 v67.79,5.4
  Bottom 0.152: v67.79,5.4 76.2,13.81 ORG_OUT.15
LED_O_C15  (via drill 0.33)
  Top 0.152: LED_O_4.4 14.92,28.26 59.05,28.26 v60.01,27.3 | v62.39,24.45 62.71,24.77 77.47,24.77 ORG_OUT.16
  Bottom 0.152: v60.01,27.3 62.39,24.92 v62.39,24.45
MUX1_S0  (via drill 0.33)
  Top 0.152: v48.42,65.88 48.42,67.15 POTS.10
  Bottom 0.152: v48.42,65.88 48.26,65.72 48.26,39.37 TEENSY++.D7
MUX1_S1  (via drill 0.33)
  Top 0.152: v48.9,65.09 47.78,65.09 47.78,67.15 POTS.11 | TEENSY++.D6 v48.9,40.01
  Bottom 0.152: v48.9,65.09 49.53,64.45 49.53,55.09 50.8,53.82 50.8,48.58 48.9,46.67 v48.9,40.01
MUX1_S2  (via drill 0.33)
  Top 0.152: v47.62,58.58 47.78,58.58 47.78,59.69 POTS.14
  Bottom 0.152: v47.62,58.58 45.72,56.67 45.72,44.61 44.45,43.34 TEENSY++.D5
MUX1_S3  (via drill 0.33)
  Top 0.152: v46.04,58.58 47.15,59.69 POTS.13
  Bottom 0.152: v46.04,58.58 43.18,55.72 43.18,43.5 41.91,42.23 TEENSY++.D4
MUX2_S0  (via drill 0.33)
  Top 0.152: v82.07,43.81 84.45,46.2 86.84,46.2 X.10 | v81.76,39.37 60.96,39.37 TEENSY++.C1
  Bottom 0.152: v82.07,43.81 81.76,43.5 v81.76,39.37
MUX2_S1  (via drill 0.33)
  Top 0.152: v77.79,48.26 80.01,48.26 81.44,46.83 86.84,46.83 X.11 | v77.15,42.23 75.09,40.16 59.37,40.16 57.31,38.1 TEENSY++.C0
  Bottom 0.152: v77.79,48.26 77.15,47.62 v77.15,42.23
MUX2_S2  (via drill 0.33)
  Top 0.152: v57.47,44.77 57.78,44.45 67.79,44.45 70.33,46.99 75.41,46.99 75.56,46.83 79.38,46.83 X.14
  Bottom 0.152: v57.47,44.77 54.61,41.91 TEENSY++.E1
MUX2_S3  (via drill 0.33)
  Top 0.152: v55.24,49.53 76.2,49.53 76.2,48.26 76.83,47.62 79.22,47.62 79.38,47.47 X.13
  Bottom 0.152: v55.24,49.53 52.07,46.35 TEENSY++.E0
MUX3_S0  (via drill 0.33)
  Top 0.152: v55.56,10.32 55.09,10.79 55.09,11.43 Y.10 | v58.42,17.62 60.96,20.16 v69.22,20.16
  Bottom 0.152: v55.56,10.32 58.42,13.18 v58.42,17.62 | v69.22,20.16 69.53,20.48 69.53,22.7 69.85,23.02 TEENSY++.C5
MUX3_S1  (via drill 0.33)
  Top 0.152: v55.4,12.86 55.56,12.86 55.56,11.59 Y.11 | v54.61,33.97 56.83,36.2 v65.41,36.2
  Bottom 0.152: v55.4,12.86 54.45,13.81 54.45,22.86 54.61,23.02 54.61,28.57 54.93,28.89 54.93,30.32 54.61,30.64 v54.61,33.97 | TEENSY++.C4 v65.41,36.2
MUX3_S2  (via drill 0.33)
  Top 0.152: v63.82,20.8 55.72,20.8 55.72,19.05 Y.14
  Bottom 0.152: v63.82,20.8 64.77,21.75 TEENSY++.C3
MUX3_S3  (via drill 0.33)
  Top 0.152: v56.36,20.16 56.36,19.05 Y.13 | v58.42,33.97 59.37,34.92 v59.69,34.92
  Bottom 0.152: v56.36,20.16 57.15,20.95 57.15,32.7 v58.42,33.97 | v59.69,34.92 62.23,37.47 TEENSY++.C2
MUX3_SIG  (via drill 0.33)
  Top 0.152: v48.42,11.91 48.74,11.91 49.05,11.59 Y.1 | v55.88,38.89 57.47,40.48 v58.74,40.48
  Bottom 0.152: v48.42,11.91 47.31,13.02 47.31,20.8 49.53,23.02 49.53,28.1 52.07,30.64 52.07,33.81 55.88,37.62 v55.88,38.89 | v58.74,40.48 63.5,45.24 63.5,52.07 TEENSY++.F3
MUX4_S0  (via drill 0.33)
  Top 0.152: v14.76,38.58 13.65,38.58 13.49,38.42 BUTTONS.10 | v13.97,49.53 15.4,50.96 18.73,50.96 18.89,50.8 v36.83,50.8
  Bottom 0.152: v14.76,38.58 13.97,39.37 v13.97,49.53 | TEENSY++.B3 v36.83,50.8
MUX4_S1  (via drill 0.33)
  Top 0.152: v16.51,37.94 13.65,37.94 13.49,37.78 BUTTONS.11 | v17.94,50.32 18.1,50.16 43.02,50.16 45.72,52.86 45.72,54.61 40.64,54.61 TEENSY++.B2
  Bottom 0.152: v16.51,37.94 17.46,38.89 17.46,40.64 17.78,40.96 17.78,50.16 v17.94,50.32
MUX4_S2  (via drill 0.33)
  Top 0.152: v38.73,42.39 37.78,41.43 33.02,41.43 33.02,37.62 32.23,36.83 25.72,36.83 24.92,37.62 20.95,37.62 BUTTONS.14
  Bottom 0.152: v38.73,42.39 40.8,44.45 40.8,52.23 TEENSY++.B1
MUX4_S3  (via drill 0.33)
  Top 0.152: v22.07,36.99 20.95,36.99 BUTTONS.13 | v22.07,51.44 22.38,51.12 36.2,51.12 37.15,52.07 43.18,52.07 TEENSY++.B0
  Bottom 0.152: v22.07,51.44 v22.07,36.99
MUX4_SIG
  Top 0.152: TEENSY++.F4 66.04,52.07 55.56,52.07 53.18,49.69 17.62,49.69 17.46,49.85 16.19,49.85 16.19,47.78 15.56,47.15 5.08,47.15 5.08,44.77 5.4,44.45 13.18,44.45 13.34,44.29 BUTTONS.1
POT_C0
  Top 0.152: POT_1.1 73.03,71.28 70.01,68.26 64.61,68.26 64.45,68.42 49.21,68.42 49.21,67.31 POTS.9
POT_C1  (via drill 0.33)
  Top 0.152: v49.69,65.88 49.69,67.15 POTS.8 | v48.58,74.61 60.17,74.61 60.8,73.98 72.23,73.98 72.55,74.3 74.3,74.3 POT_1.2
  Bottom 0.152: v49.69,65.88 48.58,66.99 v48.58,74.61
POT_C2  (via drill 0.33)
  Top 0.152: v70.64,64.61 70.48,64.77 50.48,64.77 50.48,67.15 POTS.7
  Bottom 0.152: v70.64,64.61 78.11,72.07 POT_1.3
POT_C3  (via drill 0.33)
  Top 0.152: v72.55,64.93 72.23,65.25 51.28,65.25 51.28,67.15 POTS.6
  Bottom 0.152: POT_1.4 v72.55,64.93
POT_C4  (via drill 0.33)
  Top 0.152: v85.41,65.56 51.91,65.56 51.91,67.15 POTS.5
  Bottom 0.152: v85.41,65.56 91.44,59.53 91.44,56.04 90.65,55.24 89.06,55.24 89.06,54.61 87.63,53.18 87.63,26.35 92.39,21.59 POT_2.1
POT_C5  (via drill 0.33)
  Top 0.152: v97.16,47.62 97.16,64.61 94.46,67.31 81.28,67.31 79.85,65.88 52.55,65.88 52.55,67.15 POTS.4
  Bottom 0.152: v97.16,47.62 97.16,21.75 94.46,19.05 POT_2.2
POT_C6  (via drill 0.33)
  Top 0.152: v79.69,66.67 79.22,66.2 53.18,66.2 53.18,67.15 POTS.3 | v82.23,21.27 87,16.51 POT_2.3
  Bottom 0.152: v79.69,66.67 81.44,64.93 81.44,40.01 81.12,39.69 81.12,28.89 82.23,27.78 v82.23,21.27
POT_C7  (via drill 0.33)
  Top 0.152: v94.77,69.85 81.28,69.85 79.38,67.94 64.45,67.94 64.29,68.1 53.82,68.1 53.82,67.31 POTS.2
  Bottom 0.152: v94.77,69.85 98.42,66.2 98.42,15.72 96.68,13.97 POT_2.4
POT_C8  (via drill 0.33)
  Top 0.152: v53.98,55.72 53.82,55.72 53.82,59.69 POTS.23 | v52.7,40.48 50.8,38.58 50.8,36.35 v32.7,36.35
  Bottom 0.152: v53.98,55.72 55.88,53.82 55.88,43.66 v52.7,40.48 | v32.7,36.35 33.02,36.04 33.02,9.53 POT_3.1
POT_C9  (via drill 0.33)
  Top 0.152: v20.48,55.24 21.91,56.67 53.02,56.67 53.02,59.69 POTS.22
  Bottom 0.152: v20.48,55.24 20.8,54.93 20.8,14.13 POT_3.2
POT_C10  (via drill 0.33)
  Top 0.152: v52.39,57.47 52.39,59.69 POTS.21 | v50.96,56.04 50.32,55.4 21.59,55.4 v20.16,53.98
  Bottom 0.152: v50.96,56.04 v52.39,57.47 | v20.16,53.98 20.48,53.66 20.48,11.91 POT_3.3
POT_C11  (via drill 0.33)
  Top 0.152: v20.48,56.99 51.75,56.99 51.75,59.69 POTS.20
  Bottom 0.152: v20.48,56.99 19.53,56.04 19.53,52.07 20.16,51.44 20.16,9.68 POT_3.4
POT_C12
  Top 0.152: POT_4.1 5.71,64.14 5.71,69.69 6.51,70.48 8.57,70.48 8.57,66.2 11.27,63.5 19.84,63.5 20.8,64.45 57.15,64.45 57.15,62.87 56.99,62.71 51.28,62.71 51.28,59.85 POTS.19
POT_C13  (via drill 0.33)
  Top 0.152: v9.53,62.23 21.43,62.23 25.72,57.94 50.8,57.94 50.8,58.9 50.48,59.21 50.48,59.69 POTS.18
  Bottom 0.152: v9.53,62.23 8.26,63.5 8.26,65.41 POT_4.2
POT_C14
  Top 0.152: POT_4.3 8.26,69.22 8.26,66.04 11.11,63.18 49.69,63.18 49.69,59.85 POTS.17
POT_C15
  Top 0.152: POT_4.4 5.4,71.75 5.4,63.98 6.51,62.87 49.05,62.87 49.05,59.85 POTS.16
SCL  (via drill 0.33)
  Top 0.152: v32.38,12.22 30.96,10.79 12.7,10.79 R1.P$1
  Bottom 0.152: R1.P$1 11.43,5.24 11.27,5.08 I2C.2 | TEENSY++.D0 32.07,37.78 32.07,19.37 32.38,19.05 v32.38,12.22
SDA
  Bottom 0.152: R2.P$2 13.97,5.24 14.13,5.08 I2C.1 30.32,5.08 34.29,9.05 TEENSY++.D1
X_C0  (via drill 0.33)
  Top 0.152: v84.77,45.56 86.84,45.56 X.9 | v83.19,76.2 81.92,77.47 62.87,77.47 X_1.1
  Bottom 0.152: v84.77,45.56 83.19,47.15 v83.19,76.2
X_C1  (via drill 0.33)
  Top 0.152: v84.14,44.93 86.84,44.93 X.8 | v82.55,72.87 80.8,74.61 69.37,74.61 69.06,74.3 64.77,74.3 X_1.2
  Bottom 0.152: v84.14,44.93 82.55,46.51 v82.55,72.87
X_C2  (via drill 0.33)
  Top 0.152: v83.5,44.29 86.84,44.29 X.7 | v78.58,76.83 67.31,76.83 X_1.3
  Bottom 0.152: v83.5,44.29 81.92,45.88 81.92,73.5 v78.58,76.83
X_C3
  Top 0.152: X_1.4 97.79,75.56 97.79,47.31 94.3,43.81 92.87,43.81 92.71,43.66 87.15,43.66 87,43.5 X.6
X_C4  (via drill 0.33)
  Top 0.152: v95.89,38.26 91.44,42.7 87,42.7 X.5
  Bottom 0.152: X_2.1 v95.89,38.26
X_C5
  Top 0.152: X_2.2 94.61,31.75 94.61,28.73 95.41,27.94 97.47,27.94 97.47,35.72 91.12,42.07 87,42.07 X.4
X_C6
  Top 0.152: X_2.3 97.16,29.21 97.16,35.56 91.28,41.43 87,41.43 X.3
X_C7  (via drill 0.33)
  Top 0.152: v89.53,40.8 87,40.8 X.2 | v89.53,36.67 94.3,31.91 94.3,26.67 X_2.4
  Bottom 0.152: v89.53,36.67 v89.53,40.8
X_C8  (via drill 0.33)
  Top 0.152: v82.39,40.8 79.53,40.8 X.23 | v81.76,14.61 80.64,13.49 v46.35,13.49
  Bottom 0.152: v82.39,40.8 82.55,40.64 82.55,21.91 82.87,21.59 82.87,15.72 v81.76,14.61 | v46.35,13.49 44.45,11.59 44.45,5.08 X_3.1
X_C9  (via drill 0.33)
  Top 0.152: v83.03,41.43 79.53,41.43 X.22 | v81.76,11.11 77.47,6.83 77.47,5.08 69.06,5.08 68.1,6.03 56.67,6.03 53.18,2.54 41.91,2.54 X_3.2
  Bottom 0.152: v83.03,41.43 83.03,27.94 82.87,27.78 82.87,22.07 83.19,21.75 83.19,12.54 v81.76,11.11
X_C10  (via drill 0.33)
  Top 0.152: v83.66,42.07 79.53,42.07 X.21
  Bottom 0.152: v83.66,42.07 83.66,28.1 83.19,27.62 83.19,26.99 83.5,26.67 83.5,7.78 82.55,6.83 82.55,4.29 80.17,1.91 38.1,1.91 X_3.3
X_C11  (via drill 0.33)
  Top 0.152: v80.8,43.02 79.69,43.02 79.53,42.86 X.20 | v80.33,11.59 80.01,11.91 60.48,11.91 54.93,6.35 38.1,6.35 X_3.4
  Bottom 0.152: v80.8,43.02 80.33,42.55 v80.33,11.59
X_C12  (via drill 0.33)
  Top 0.152: v14.76,35.08 53.34,35.08 53.34,38.58 55.88,41.12 75.09,41.12 77.31,43.34 79.38,43.34 X.19
  Bottom 0.152: v14.76,35.08 6.35,43.5 6.35,46.35 X_4.1
X_C13  (via drill 0.33)
  Top 0.152: v25.08,43.81 38.26,43.81 40.16,41.91 75.41,41.91 77.47,43.97 79.22,43.97 79.38,44.13 X.18 | v23.97,53.02 11.43,53.02 11.11,52.7 5.08,52.7 X_4.2
  Bottom 0.152: v25.08,43.81 23.97,44.93 v23.97,53.02
X_C14  (via drill 0.33)
  Top 0.152: v25.08,48.26 51.12,48.26 55.24,44.13 67.94,44.13 68.26,44.45 75.41,44.45 75.56,44.61 79.22,44.61 79.38,44.77 X.17 | v24.92,57.78 3.33,57.78 2.54,56.99 2.54,53.98 X_4.3
  Bottom 0.152: v25.08,48.26 24.92,48.42 v24.92,57.78
X_C15  (via drill 0.33)
  Top 0.152: v78.11,45.24 79.22,45.24 79.38,45.4 X.16 | v67.31,72.87 66.52,73.66 54.29,73.66 53.66,74.3 49.21,74.3 48.9,73.98 47.94,73.98 44.77,77.15 10.32,77.15 2.22,69.06 2.22,52.7 4.29,52.7 5.08,53.5 5.08,56.52 X_4.4
  Bottom 0.152: v78.11,45.24 78.42,45.56 78.42,55.88 67.31,66.99 v67.31,72.87
Y_C0  (via drill 0.33)
  Top 0.152: v54.61,10.32 54.45,10.32 54.45,11.43 Y.9 | v47.94,16.83 46.04,18.73 v31.75,18.73
  Bottom 0.152: v54.61,10.32 53.66,11.27 53.66,15.24 52.07,16.83 v47.94,16.83 | v31.75,18.73 31.75,32.54 27.94,36.35 27.94,61.91 29.84,63.82 29.84,74.14 31.27,75.56 Y_1.1
Y_C1  (via drill 0.33)
  Top 0.152: v53.66,10.32 53.66,11.43 Y.8 | v45.72,43.66 41.91,47.47 40.32,47.47 v40.16,47.31
  Bottom 0.152: v53.66,10.32 53.34,10.64 53.34,15.08 51.91,16.51 48.58,16.51 48.58,12.7 49.05,12.22 49.05,11.59 48.74,11.27 46.99,11.27 46.99,36.35 45.72,37.62 v45.72,43.66 | v40.16,47.31 40.48,47.62 40.48,52.7 40.64,52.86 40.64,68.1 41.91,69.37 41.91,71.75 Y_1.2
Y_C2  (via drill 0.33)
  Top 0.152: v54.45,12.86 53.18,12.86 53.18,11.59 Y.7 | v58.26,71.6 58.1,71.44 44.77,71.44 Y_1.3
  Bottom 0.152: v54.45,12.86 55.09,12.22 56.99,12.22 56.99,20.32 59.69,23.02 59.69,26.67 59.37,26.99 59.37,30.32 59.69,30.64 59.69,33.97 58.42,35.24 58.42,39.85 58.1,40.16 58.1,52.55 58.42,52.86 58.42,54.45 58.1,54.77 58.1,71.44 v58.26,71.6
Y_C3  (via drill 0.33)
  Top 0.152: v29.84,12.86 52.23,12.86 52.23,11.59 Y.6
  Bottom 0.152: v29.84,12.86 21.11,21.59 21.11,73.03 24.92,76.83 43.18,76.83 Y_1.4
Y_C4  (via drill 0.33)
  Top 0.152: v96.68,14.92 93.34,11.59 85.88,11.59 85.25,12.22 60.33,12.22 56.52,8.41 47.78,8.41 47.78,12.22 48.1,12.54 51.59,12.54 51.59,11.59 Y.5
  Bottom 0.152: v96.68,14.92 98.11,16.35 98.11,56.83 Y_2.1
Y_C5  (via drill 0.33)
  Top 0.152: v52.7,10.32 51.12,10.32 51.12,11.43 Y.4 | v52.7,14.76 53.02,15.08 75.09,15.08 v84.45,24.45 | v85.41,50.96 89.69,55.24 94.61,55.24 Y_2.2
  Bottom 0.152: v52.7,14.76 v52.7,10.32 | v84.45,24.45 84.77,24.77 84.77,44.61 85.41,45.24 v85.41,50.96
Y_C6  (via drill 0.33)
  Top 0.152: v86.36,13.18 60.33,13.18 56.2,9.05 50.48,9.05 50.48,11.43 Y.3
  Bottom 0.152: v86.36,13.18 93.5,20.32 95.25,20.32 95.25,25.56 94.61,26.19 94.61,41.59 94.93,41.91 94.93,50.64 94.61,50.96 94.61,52.7 Y_2.3
Y_C7  (via drill 0.33)
  Top 0.152: v87.95,12.22 85.72,12.22 85.41,12.54 60.17,12.54 56.36,8.73 49.85,8.73 49.85,11.43 Y.2
  Bottom 0.152: v87.95,12.22 93.5,17.78 97.79,17.78 97.79,49.53 Y_2.4
Y_C8  (via drill 0.33)
  Top 0.152: v49.85,15.88 49.85,18.89 Y.23
  Bottom 0.152: v49.85,15.88 49.85,4.45 51.75,2.54 68.58,2.54 Y_3.1
Y_C9  (via drill 0.33)
  Top 0.152: v69.22,15.72 50.48,15.72 50.48,18.89 Y.22
  Bottom 0.152: v69.22,15.72 69.85,15.08 69.85,8.41 66.04,4.6 Y_3.2
Y_C10  (via drill 0.33)
  Top 0.152: v59.69,16.35 51.12,16.35 51.12,18.89 Y.21
  Bottom 0.152: v59.69,16.35 59.69,7.62 Y_3.3
Y_C11  (via drill 0.33)
  Top 0.152: v59.05,16.99 51.75,16.99 51.75,18.89 Y.20
  Bottom 0.152: v59.05,16.99 59.05,5.71 Y_3.4
Y_C12
  Top 0.152: Y_4.1 9.68,20.16 52.23,20.16 52.23,19.05 Y.19
Y_C13
  Top 0.152: Y_4.2 3.81,28.1 11.43,20.48 53.02,20.48 53.02,19.05 Y.18
Y_C14  (via drill 0.33)
  Top 0.152: v5.71,27.15 12.06,20.8 53.66,20.8 53.66,19.05 Y.17
  Bottom 0.152: v5.71,27.15 5.08,27.78 5.08,29.84 Y_4.3
Y_C15  (via drill 0.33)
  Top 0.152: v5.71,28.1 12.7,21.11 54.29,21.11 54.29,19.05 Y.16
  Bottom 0.152: v5.71,28.1 5.4,28.42 5.4,32.07 Y_4.4

### Text on the board
tValues: (+) | (-) | 5V | (-) | (+) | (+) | (-) | SCL | SDA | (-) | (+) | (+) | (-)